# Altium project cs301_YourGroupNumber.PrjPCB
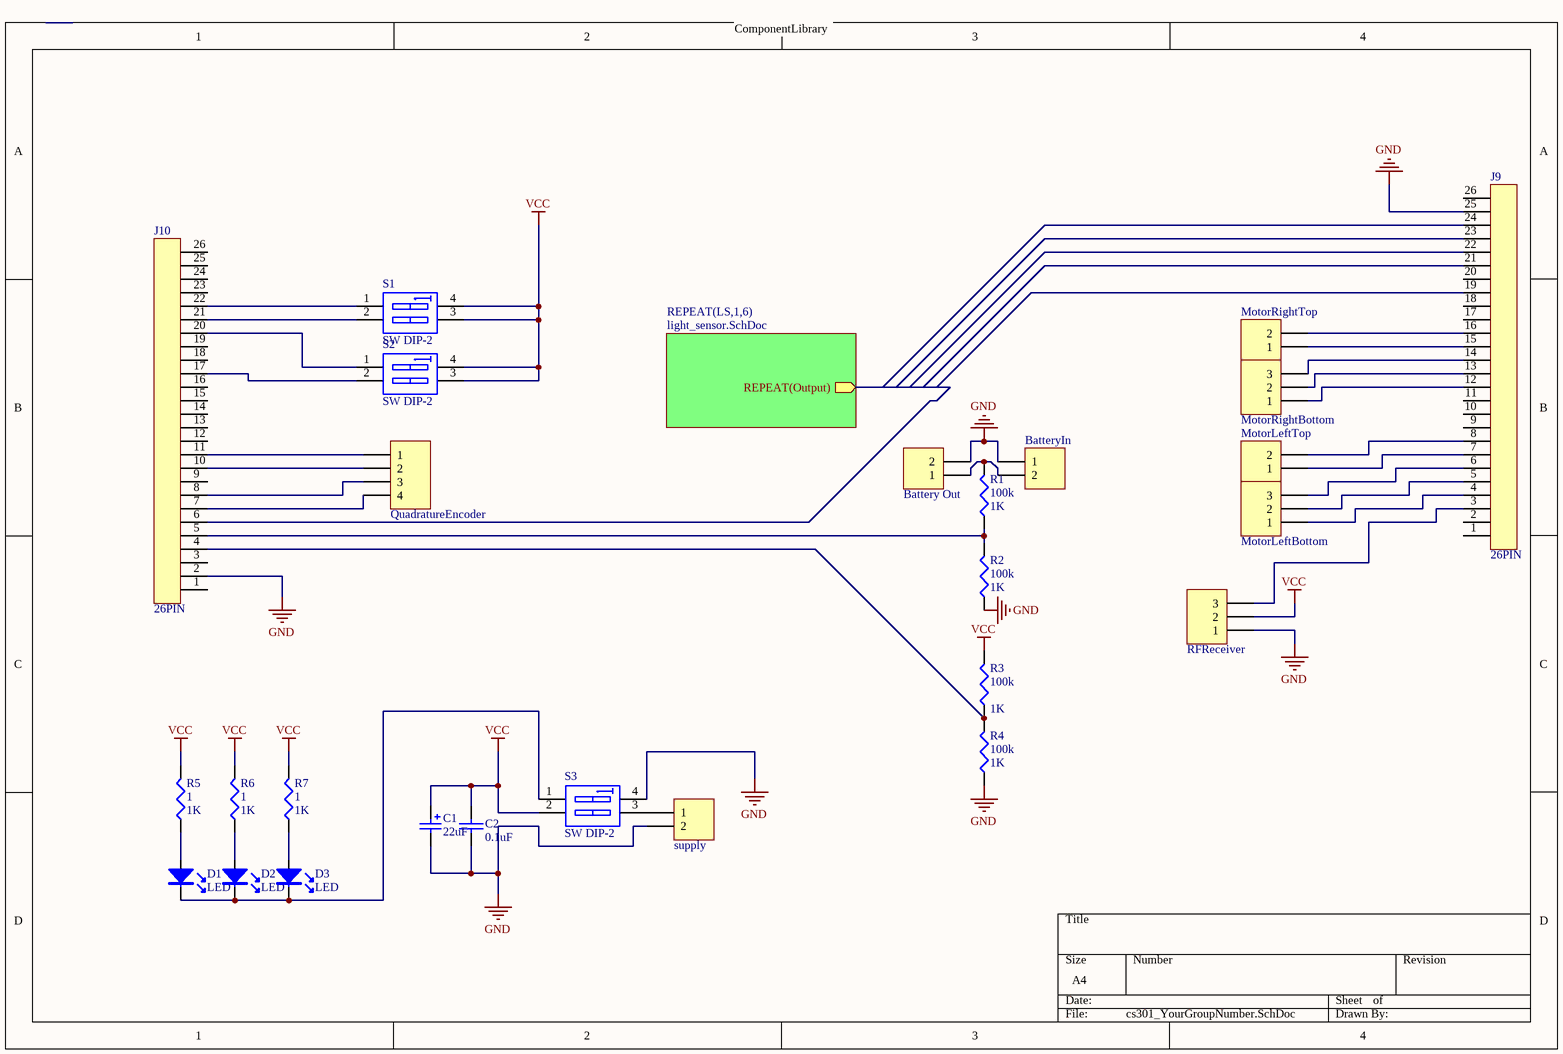
[diagram p0: cs301_YourGroupNumber.SchDoc]
2 sheets, 92 parts. Net scope: hierarchical (ports join the sheet entries above them; power ports are global).
Board file: cs301_YourGroupNumber.PcbDoc
Sheets:
  cs301_YourGroupNumber.SchDoc
    LS1 = light_sensor.SchDoc
    LS2 = light_sensor.SchDoc
    LS3 = light_sensor.SchDoc
    LS4 = light_sensor.SchDoc
    LS5 = light_sensor.SchDoc
    LS6 = light_sensor.SchDoc

## Sheet cs301_YourGroupNumber.SchDoc
size A4

### Parts
Battery_Out  2 Way  [ECE-600102STTH]  (value not drawn)
BatteryIn  2 Way  [ECE-600102STTH]  (value not drawn)
C1  22uF  [ECE-CAPAE6.3X5.4SM]
C2  0.1uF  [ECE-CAPC2012-0805SM]
D1  LED  [LED0.1/5MM]
D2  LED  [LED0.1/5MM]
D3  LED  [LED0.1/5MM]
J9  26PIN  [SIP26]
J10  26PIN  [SIP26]
MotorLeftBottom  3 Way  [ECE-600103STTH]  (value not drawn)
MotorLeftTop  2 Way  [ECE-600102STTH]  (value not drawn)
MotorRightBottom  3 Way  [ECE-600103STTH]  (value not drawn)
MotorRightTop  2 Way  [ECE-600102STTH]  (value not drawn)
QuadratureEncoder  4 Way  [ECE-600104STTH]  (value not drawn)
R1  100k  value 1K  [J1-0603]
R2  100k  value 1K  [J1-0603]
R3  100k  value 1K  [J1-0603]
R4  100k  value 1K  [J1-0603]
R5  1  value 1K  [J1-0603]
R6  1  value 1K  [J1-0603]
R7  1  value 1K  [J1-0603]
RFReceiver  3 Way  [ECE-600103STTH]  (value not drawn)
S1  SW DIP-2  [DIP-4]
S2  SW DIP-2  [DIP-4]
S3  SW DIP-2  [DIP-4]
supply  2 Way  [ECE-600102STTH]  (value not drawn)

### Sub-sheets
REPEAT(LS,1,6) = light_sensor.SchDoc: REPEAT(Output) (out)

### Nets
GND: Battery_Out.2 BatteryIn.1 C1.2 C2.2 J9.25 J10.2 R2.1 R4.1 RFReceiver.1 S3.4(B1) supply.2
VCC: C1.1 C2.1 R3.2 R5.2 R6.2 R7.2 RFReceiver.2 S1.3(B2) S1.4(B1) S2.3(B2) S2.4(B1) S3.2(A2)
NetBattery_Out_1: Battery_Out.1 BatteryIn.2 R1.2
NetD1_A: D1.A R5.1
NetD1_K: D1.K D2.K D3.K S3.1(A1)
NetD2_A: D2.A R6.1
NetD3_A: D3.A R7.1
NetJ9_3: J9.3 RFReceiver.3
NetJ9_4: J9.4 MotorLeftBottom.1
NetJ9_5: J9.5 MotorLeftBottom.2
NetJ9_6: J9.6 MotorLeftBottom.3
NetJ9_7: J9.7 MotorLeftTop.1
NetJ9_8: J9.8 MotorLeftTop.2
NetJ9_12: J9.12 MotorRightBottom.1
NetJ9_13: J9.13 MotorRightBottom.2
NetJ9_14: J9.14 MotorRightBottom.3
NetJ9_15: J9.15 MotorRightTop.1
NetJ9_16: J9.16 MotorRightTop.2
NetJ10_4: J10.4 R3.1 R4.2
NetJ10_5: J10.5 R1.1 R2.2
NetJ10_7: J10.7 QuadratureEncoder.4
NetJ10_8: J10.8 QuadratureEncoder.3
NetJ10_10: J10.10 QuadratureEncoder.2
NetJ10_11: J10.11 QuadratureEncoder.1
NetJ10_17: J10.17 S2.2(A2)
NetJ10_20: J10.20 S2.1(A1)
NetJ10_21: J10.21 S1.2(A2)
NetJ10_22: J10.22 S1.1(A1)
NetS3_3: S3.3(B2) supply.1

Not connected (* = marked no-connect by the designer): J9 1 2 9 10 11 17 18 19 20 21 22 23 24 26; J10 1 3 6 9 12 13 14 15 16 18 19 23 24 25 26

### Notes on the sheet
- ComponentLibrary

### Library data of the parts
Battery_Out BatteryIn MotorLeftTop MotorRightTop supply = CON000001: HEADER POLARISED 2WAY TH; Manufactuer: GTK; Manufacturer-PN: 600102ST; Assembly Method: Through hole; Item Type: Item; Path: ece/ts/Lists/Stock Inventory; UoA Stock#: CON000001; Value: 2 Way; Size/Package: 2.54 Radial; Datasheet Link: http://share.engineering.auckland.ac.nz/ece/ts/Student%20Documents/polarised_connectors.pdf; Supplier1: Elecon; Supplier1-PN: YY3N02; Supplier2: Active Components; Supplier2-PN: 600102ST; Component Type: NA; Category: Connector; Status: Active
C1 = CAP 22uF/35V SM: Polarized Capacitor (Radial); Revision: July-2002: Re-released for DXP Platform.; Value: 22uF
C2 = CAP 0805 SM: Capacitor; Value: *
MotorLeftBottom MotorRightBottom RFReceiver = CON000002: HEADER POLARISED 3WAY TH; Manufactuer: GTK; Manufacturer-PN: 600103ST; Assembly Method: Through hole; Item Type: Item; Path: ece/ts/Lists/Stock Inventory; UoA Stock#: CON000002; Value: 3 Way; Size/Package: 2.54 Radial; Datasheet Link: http://share.engineering.auckland.ac.nz/ece/ts/Student%20Documents/polarised_connectors.pdf; Supplier1: Elecon; Supplier1-PN: YY3N03; Supplier2: Active Components; Supplier2-PN: 600103ST; Component Type: NA; Category: Connector; Status: Active
QuadratureEncoder = CON000003: HEADER POLARISED 4WAY TH; Manufactuer: GTK; Manufacturer-PN: 600104ST; Assembly Method: Through hole; Item Type: Item; Path: ece/ts/Lists/Stock Inventory; UoA Stock#: CON000003; Value: 4 Way; Size/Package: 2.54 Radial; Datasheet Link: http://share.engineering.auckland.ac.nz/ece/ts/Student%20Documents/polarised_connectors.pdf; Supplier1: Elecon; Supplier1-PN: YY3N04; Supplier2: Active Components; Supplier2-PN: 600104ST; Component Type: NA; Category: Connector; Status: Active
R1-R7 = Res3: Resistor; Published: 8-Jun-2000; LatestRevisionDate: 29-May-2009; LatestRevisionNote: IPC-7351 Footprint Added.; PackageReference: J1-0603; Publisher: Altium Limited; PackageDescription: Chip Resistor
S1-S3 = SW DIP-2: DIP Switch, 2 Position, SPST; Published: 24-Mar-1999; LatestRevisionDate: 17-Jul-2002; LatestRevisionNote: Re-released for DXP Platform.; PackageReference: DIP-4; Publisher: Altium Limited

## Sheet light_sensor.SchDoc
size A4
Used 6 times, as channels LS1, LS2, LS3, LS4, LS5, LS6. Parts and nets are listed once, with the designators drawn on the sheet.
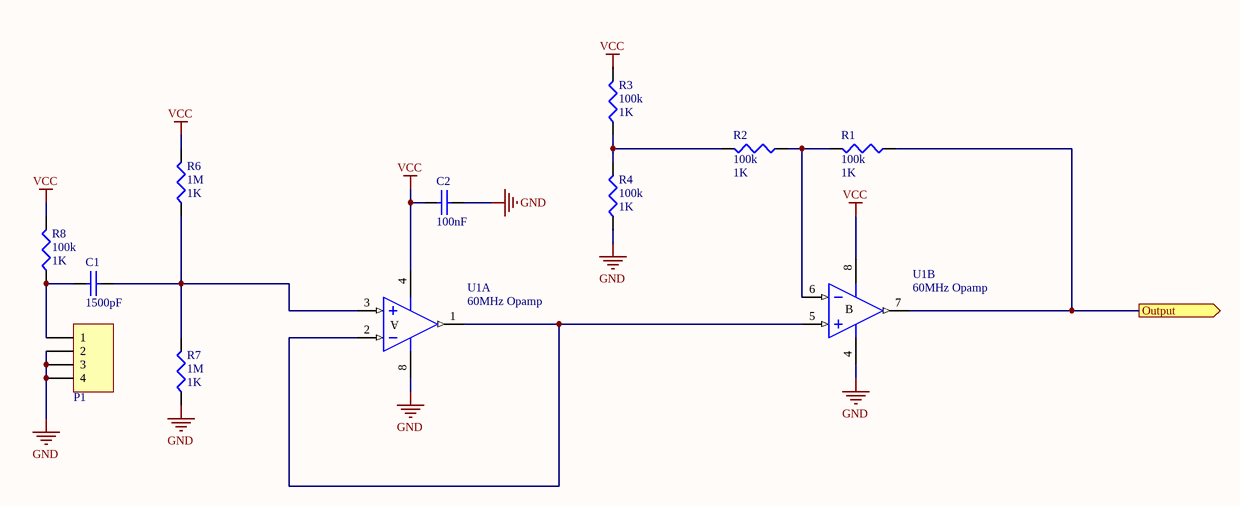
[diagram p1: light_sensor.SchDoc]

### Parts
C1  1500pF  [ECE-CAPC1608-0603SM]
C2  100nF  [ECE-CAPC1608-0603SM]
P1  Phototransistor  [ECE-600104STTH]  (value not drawn)
R1  100k  value 1K  [J1-0603]
R2  100k  value 1K  [J1-0603]
R3  100k  value 1K  [J1-0603]
R4  100k  value 1K  [J1-0603]
R6  1M  value 1K  [J1-0603]
R7  1M  value 1K  [J1-0603]
R8  100k  value 1K  [J1-0603]
U1  60MHz Opamp  [SO-8]  (parts A,B of 2)

### Ports
Output (out)

### Nets
GND: C2.2 P1.2 P1.3 P1.4 R4.1 R7.1 U1.4(V-) U1.8(V+)
VCC: C2.1 R3.2 R6.2 R8.2 U1.4(V-) U1.8(V+)
Output: R1.1 U1.7(OUT) ; port Output
NetC1_1: C1.1 R6.1 R7.2 U1.3(IN+)
NetC1_2: C1.2 P1.1 R8.1
NetR1_2: R1.2 R2.1 U1.6(IN-)
NetR2_2: R2.2 R3.1 R4.2
NetU1_1: U1.1(OUT) U1.2(IN-) U1.5(IN+)

### Channels
LS1: designators end in _LS1; ports Output=NetR1_LS1_1
LS2: designators end in _LS2; ports Output=NetR1_LS2_1
LS3: designators end in _LS3; ports Output=NetR1_LS3_1
LS4: designators end in _LS4; ports Output=NetR1_LS4_1
LS5: designators end in _LS5; ports Output=NetR1_LS5_1
LS6: designators end in _LS6; ports Output=NetR1_LS6_1

### Notes on the sheet
- (in symbol LT6221, part A) A
- (in symbol LT6221, part B) B

### Library data of the parts
C1 = CAP000613: CAP CER 1500pF 50V X7R SM0603; Manufactuer: Samsung; Manufacturer-PN: CL10B152KB8SFNC; Assembly Method: Surface Mount; Item Type: Item; Path: ece/ts/Lists/Stock Inventory; Value: 1500pF; UoA Stock#: CAP000613; Size/Package: 0603 (1608 Metric); Voltage/Current: 50V; Supplier1: Digikey; Supplier1-PN: 1276-1960-2-ND; Component Type: CAP-0603-1.5nF; Category: Capacitor; Status: Active
C2 = CAP000624: CAP CER 100nF 25V X7R SM0603; Manufactuer: Kemet; Manufacturer-PN: C0603C104K3RACTU; Assembly Method: Surface Mount; Item Type: Item; Path: ece/ts/Lists/Stock Inventory; Value: 100nF; UoA Stock#: CAP000624; Size/Package: 0603 (1608 Metric); Voltage/Current: 25V; Supplier1: Digikey; Supplier1-PN: 399-1281-2-ND; Component Type: CAP-0603-100nF; Category: Capacitor; Status: Active
P1 = CON000003: as QuadratureEncoder on sheet cs301_YourGroupNumber; UoA Stock#: CON000003; Value: 4 Way; Size/Package: 2.54 Radial; Datasheet Link: http://share.engineering.auckland.ac.nz/ece/ts/Student%20Documents/polarised_connectors.pdf; Supplier1: Elecon; Supplier1-PN: YY3N04; Supplier2: Active Components; Supplier2-PN: 600104ST; Component Type: NA; Category: Connector; Status: Active
R1-R4 R6-R8 = Res3: Resistor; Published: 8-Jun-2000; LatestRevisionDate: 29-May-2009; LatestRevisionNote: IPC-7351 Footprint Added.; PackageReference: J1-0603; Publisher: Altium Limited; PackageDescription: Chip Resistor
U1 = LT6221

## Nets that join several sheets
GND: cs301_YourGroupNumber (11 pins), LS1 (8 pins), LS2 (8 pins), LS3 (8 pins), LS4 (8 pins), LS5 (8 pins), LS6 (8 pins)
VCC: cs301_YourGroupNumber (12 pins), LS1 (6 pins), LS2 (6 pins), LS3 (6 pins), LS4 (6 pins), LS5 (6 pins), LS6 (6 pins)